# Altium schematic sheet Sheet1.SchDoc
size A; SheetNumber: 1; SheetTotal: 1
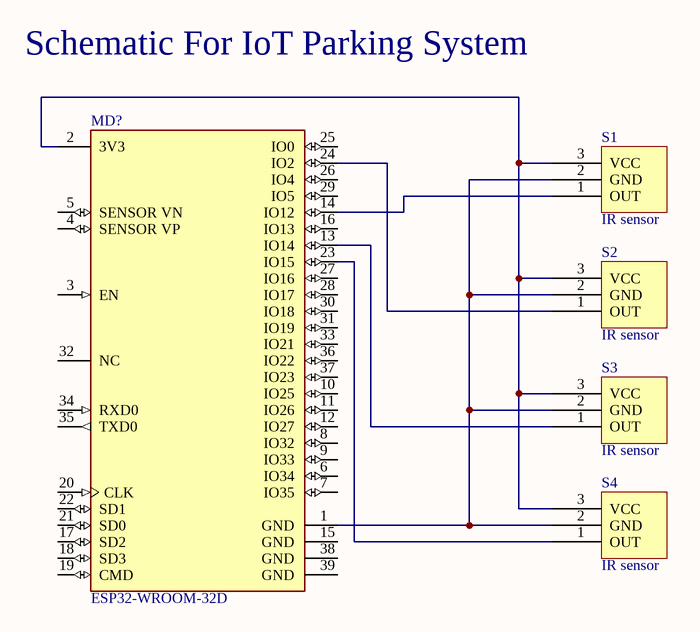
[diagram p0: Sheet1.SchDoc]

## Parts
MD?  ESP32-WROOM-32D  [FP-ESP32-WROOM-32D-MFG]
S1  IR sensor
S2  IR sensor
S3  IR sensor
S4  IR sensor

## Nets
NetMD?_1: MD?.1(GND) S1.2(GND) S2.2(GND) S3.2(GND) S4.2(GND)
NetMD?_2: MD?.2(3V3) S1.3(VCC) S2.3(VCC) S3.3(VCC) S4.3(VCC)
NetMD?_13: MD?.13(IO14) S3.1(OUT)
NetMD?_14: MD?.14(IO12) S1.1(OUT)
NetMD?_23: MD?.23(IO15) S4.1(OUT)
NetMD?_24: MD?.24(IO2) S2.1(OUT)

Not connected (* = marked no-connect by the designer): MD? 3(EN) 4(SENSOR_VP) 5(SENSOR_VN) 6(IO34) 7(IO35) 8(IO32) 9(IO33) 10(IO25) 11(IO26) 12(IO27) 15(GND) 16(IO13) 17(SD2) 18(SD3) 19(CMD) 20(CLK) 21(SD0) 22(SD1) 25(IO0) 26(IO4) 27(IO16) 28(IO17) 29(IO5) 30(IO18) 31(IO19) 32(NC) 33(IO21) 34(RXD0) 35(TXD0) 36(IO22) 37(IO23) 38(GND) 39(GND)

## Notes on the sheet
- Schematic For IoT Parking System

## Library data of the parts
MD? = CMP-194065-000003-1: WIFI MODULE 32MBITS SPI FLASH; Manufacturer: Espressif Systems; Max Supply Voltage: 3.6V; Nominal Supply Current: 500mA; Max Frequency: 2484MHz; Number Of Adc Channels: 16; Number Of Gpio: 32; Interface: I2C,SPI,UART,Ethernet,I2S,Other; Data Rate: 150Mbits/s; Min Supply Voltage: 3V; Bandwidth: 72MHz; Sensitivity: -98dBm; Octopart: https://octopart.com/esp32-wroom-32d-espressif+systems-91040050; Package: ESP32-WROOM-32D; ComponentLink2URL: https://www.espressif.com/sites/default/files/documentation/esp32-wroom-32d_esp32-wroom-32u_datasheet_en.pdf; Lead Free: Yes; Category: UNK; Mouser Description: Wi-Fi/BT BLE Module ESP32-D0WD, SPI Flash, UART, P; Device Class L1: Integrated Circuits (ICs); RoHS: TRUE; Temperature Range Low: -40°C; ComponentLink2Description: Datasheet; Digikey Description: WIFI MODULE 32MBITS SPI FLASH; Height: 3.2mm; Temperature: -40°C to +85°C; Manufacturer Part Number: ESP32-WROOM-32D; Device Class L3: Transceivers; Device Class L2: RF Semiconductors and Devices; Temperature Range High: +85°C; Automotive: No
S1-S4 = Component_1